# Altium schematic sheet Day10F206.SchDoc
size B
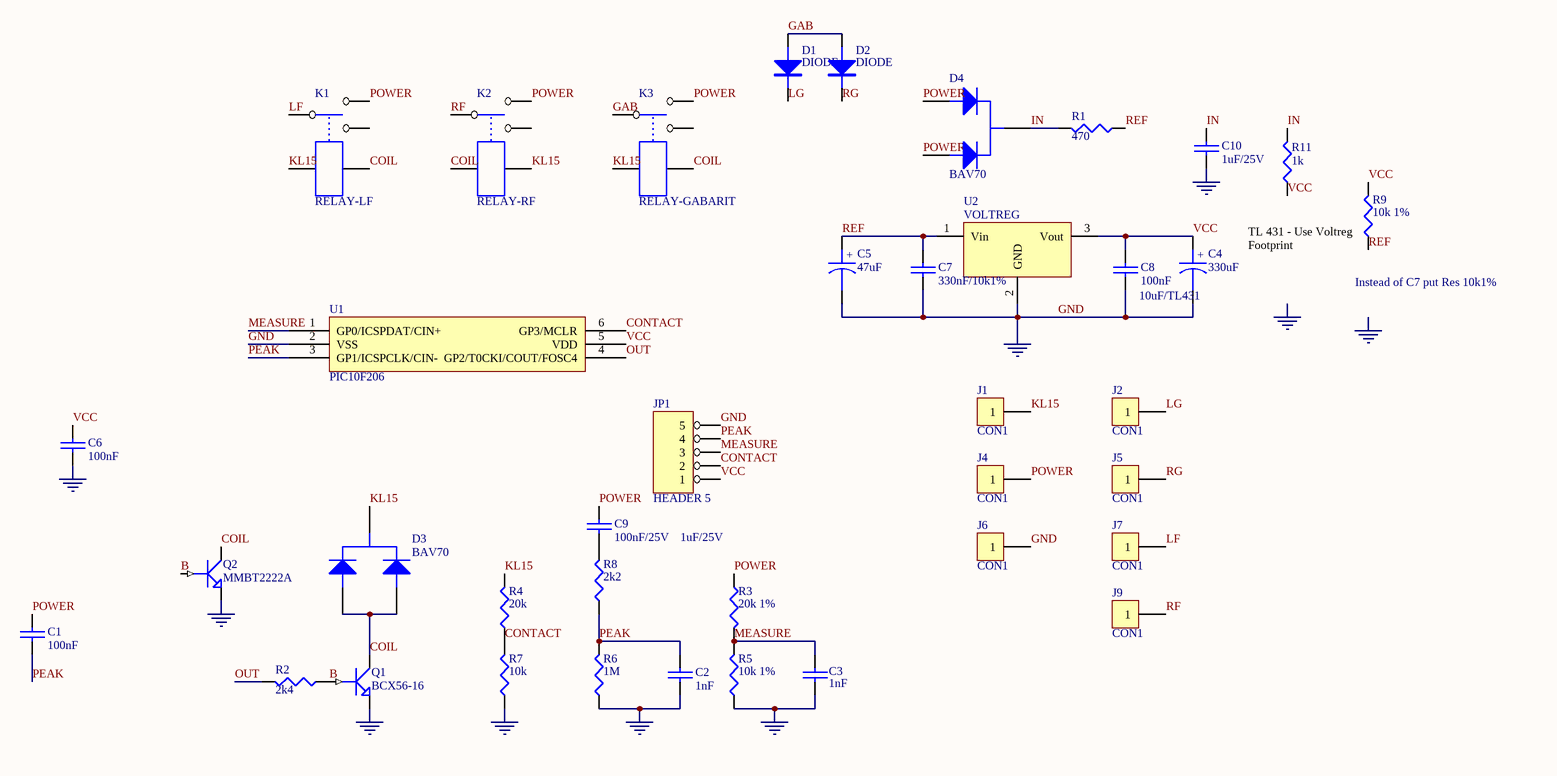
[diagram p0: Day10F206.SchDoc]

## Parts
C1  100nF  [0603]
C2  1nF  [0603]
C3  1nF  [0603]
C4  330uF  [RA 5MM]
C5  47uF  [RA 5MM]
C6  100nF  [0805]
C7  330nF/10k1%  [0805]
C8  100nF  [0805]
C9  100nF/25V  [0603]
C10  1uF/25V  [0805]
D1  DIODE  [DIODE0.7 - Radial]
D2  DIODE  [DIODE0.7 - Radial]
D3  BAV70  [SOT-23]
D4  BAV70  [SOT-23]
J1  CON1  [SIP1 - WIRE]
J2  CON1  [SIP1 - WIRE]
J4  CON1  [SIP1 - WIRE]
J5  CON1  [SIP1 - WIRE]
J6  CON1  [SIP1 - WIRE]
J7  CON1  [SIP1 - WIRE]
J9  CON1  [SIP1 - WIRE]
JP1  HEADER 5  [SIP5 - PGM 2]
K1  RELAY-LF  [RELAY5PIN]
K2  RELAY-RF  [RELAY5PIN]
K3  RELAY-GABARIT  [RELAY5PIN]
Q1  BCX56-16  [SOT-89]
Q2  MMBT2222A  [SOT-23]
R1  470  [0603]
R2  2k4  [0603]
R3  20k 1%  [0603]
R4  20k  [0805]
R5  10k 1%  [0603]
R6  1M  [0603]
R7  10k  [0603]
R8  2k2  [0603]
R9  10k 1%  [0805]
R11  1k  [0805]
U1  PIC10F206  [SOT23 - 6]
U2  VOLTREG  [LINEAR VOLTREG 3]

## Nets
GND: C2.2 C3.1 C4.2 C5.2 C6.2 C7.2 C8.2 C10.2 J6.1 JP1.5 Q1.3(E) Q2.3(E) R5.1 R6.1 R7.1 U1.2(VSS) U2.2(GND)
B: Q1.1(B) Q2.1(B) R2.1
COIL: D3.1(A1) D3.3(A2) K1.5 K2.4 K3.5 Q1.2(C) Q2.2(C)
CONTACT: JP1.2 R4.1 R7.2 U1.6(GP3/MCLR)
GAB: D1.A D2.A K3.1
IN: C10.1 D4.2(K) R1.2 R11.2
KL15: D3.2(K) J1.1 K1.4 K2.5 K3.4 R4.2
LF: J7.1 K1.1
LG: D1.K J2.1
MEASURE: C3.2 JP1.3 R3.2 R5.2 U1.1(GP0/ICSPDAT/CIN+)
OUT: R2.2 U1.4(GP2/T0CKI/COUT/FOSC4)
PEAK: C1.2 C2.1 JP1.4 R6.2 R8.1 U1.3(GP1/ICSPCLK/CIN-)
POWER: C1.1 C9.1 D4.1(A1) D4.3(A2) J4.1 K1.2 K2.2 K3.2 R3.1
REF: C5.1 C7.1 R1.1 R9.1 U2.1(Vin)
RF: J9.1 K2.1
RG: D2.K J5.1
VCC: C4.1 C6.1 C8.1 JP1.1 R9.2 R11.1 U1.5(VDD) U2.3(Vout)
NetC9_2: C9.2 R8.2

Not connected (* = marked no-connect by the designer): K1 3; K2 3; K3 3

## Notes on the sheet
- (near R9) TL 431 - Use Voltreg Footprint
- (near C4) 10uF/TL431
- (near R9) Instead of C7 put Res 10k1%
- 1uF/25V
- Labels drawn without touching a wire or pin: GND
- (in symbol CAPACITOR POL) +

## Library data of the parts
C1-C3 C6-C10 = CAP: Capacitor
C4 C5 = CAPACITOR POL: Capacitor
D3 D4 = DUAL DIODE BAV70
J1 J2 J4-J7 J9 = CON1: Connector
K1-K3 = RELAY-SPDT
Q1 Q2 = NPN1: NPN Transistor
R1-R9 R11 = RES1